# Altium schematic sheet SpeakEasy_Power_Connectors.SchDoc
size A
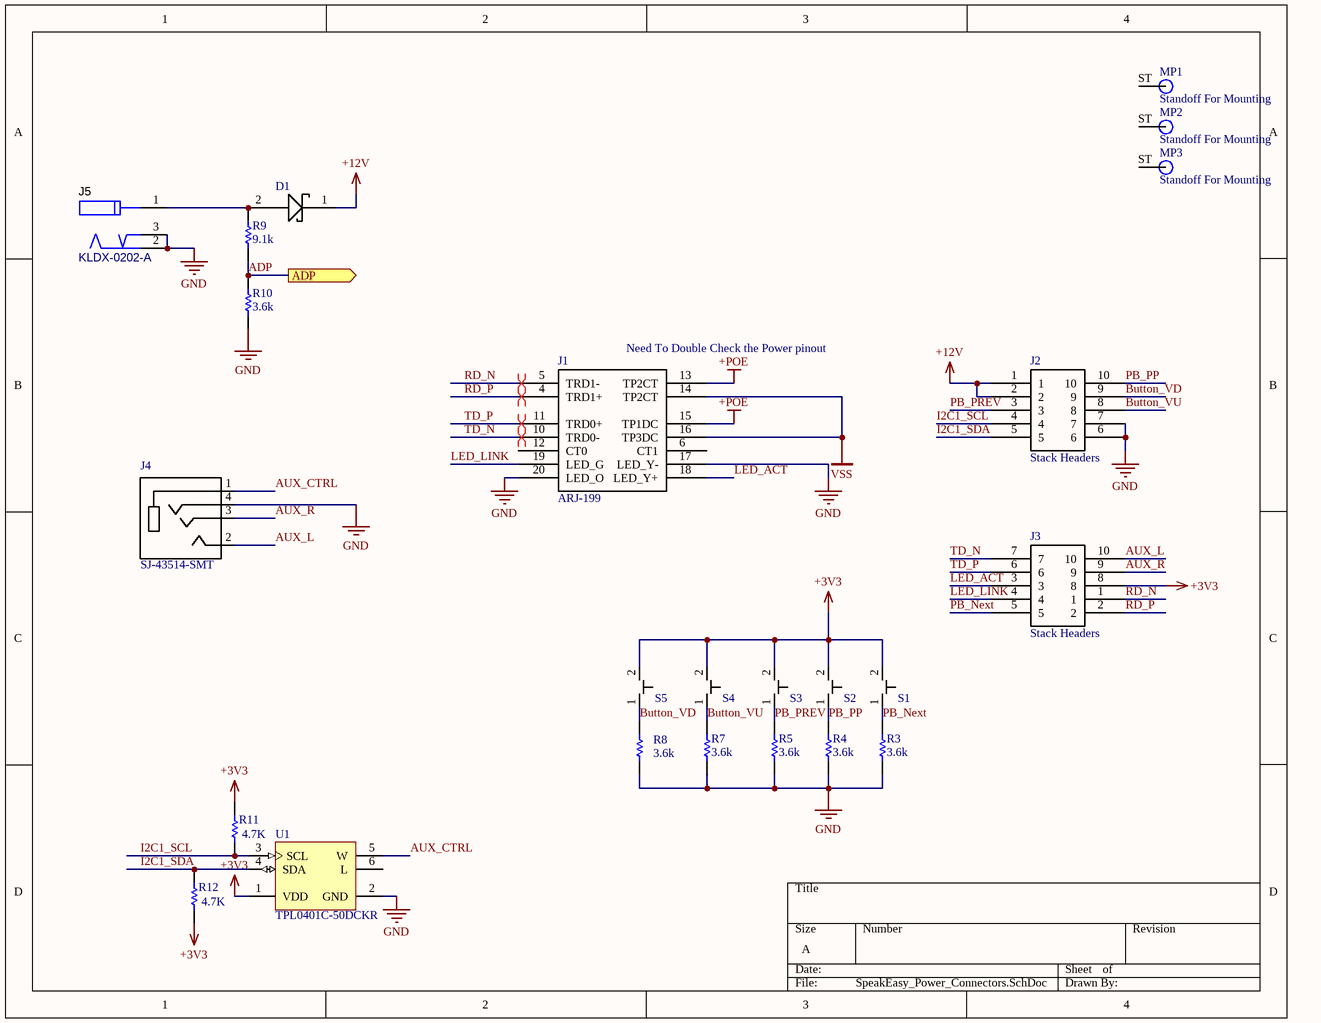
[diagram p0: SpeakEasy_Power_Connectors.SchDoc]

## Parts
D1  Shottkey Diode  [DO-220AA]  (value not drawn)
J1  ARJ-199  [ARJ-199]
J2  Stack Headers  [TSW-105]
J3  Stack Headers  [TSW-105]
J4  SJ-43514-SMT  [CUI_SJ-43514-SMT]
J5  KLDX-0202-A  [KYCN-KLDX-0202-A_V]
MP1  Standoff For Mounting  [STO]
MP2  Standoff For Mounting  [STO]
MP3  Standoff For Mounting  [STO]
R3  3.6k  [RESC0805(2012)_L]
R4  3.6k  [RESC0805(2012)_L]
R5  3.6k  [RESC0805(2012)_L]
R7  3.6k  [RESC0805(2012)_L]
R8  3.6k  [RESC0805(2012)_L]
R9  9.1k  [RESC0805(2012)_L]
R10  3.6k  [RESC0805(2012)_L]
R11  4.7k  [RESC0603(1608)_N]
R12  4.7K  [RESC0603(1608)_N]
S1  SPST Switch  [TL1105]  (value not drawn)
S2  SPST Switch  [TL1105]  (value not drawn)
S3  SPST Switch  [TL1105]  (value not drawn)
S4  SPST Switch  [TL1105]  (value not drawn)
S5  SPST Switch  [TL1105]  (value not drawn)
U1  TPL0401C-50DCKR  [TI-DCK6_V]

## Ports
ADP (out)

## Nets
+3V3: J3.8 R11.2 R12.1 S1.2 S2.2 S3.2 S4.2 S5.2 U1.1(VDD)
+12V: D1.1(-) J2.1 J2.2
+POE: J1.13(TP2CT) J1.15(TP1DC)
GND: J1.17(LED_Y-) J1.20(LED_O) J2.6 J2.7 J4.4(RING2) J5.2 J5.3 R3.2 R4.2 R5.2 R7.1 R8.1 R10.1 U1.2(GND)
VSS: J1.14(TP2CT) J1.16(TP3DC)
ADP: R9.1 R10.2 ; port ADP
AUX_CTRL: J4.1(SLEEVE) U1.5(W)
AUX_L: J3.10 J4.2(TIP)
AUX_R: J3.9 J4.3(RING1)
Button_VD: J2.9 R8.2 S5.1
Button_VU: J2.8 R7.2 S4.1
I2C1_SCL: J2.4 R11.1 U1.3(SCL)
I2C1_SDA: J2.5 R12.2 U1.4(SDA)
LED_ACT: J1.18(LED_Y+) J3.3
LED_LINK: J1.19(LED_G) J3.4
PB_Next: J3.5 R3.1 S1.1
PB_PP: J2.10 R4.1 S2.1
PB_PREV: J2.3 R5.1 S3.1
RD_N: J1.5(TRD1-) J3.1
RD_P: J1.4(TRD1+) J3.2
TD_N: J1.10(TRD0-) J3.7
TD_P: J1.11(TRD0+) J3.6
NetD1_2: D1.2(+) J5.1 R9.2

Not connected (* = marked no-connect by the designer): J1 6(CT1) 12(CT0); MP1 ST(1); MP2 ST(1); MP3 ST(1); U1 6(L)

## Layout directives
differential pair; differential pair class TX_DIFF; rule Matched Net Lengths [Tolerance = 20mil]: TD_N, TD_P
differential pair; differential pair class RX Diff; rule Matched Net Lengths [Tolerance = 20mil]: RD_N, RD_P

## Notes on the sheet
- (near J1) Need To Double Check the Power pinout

## Library data of the parts
D1 = V3P6: ComponentLink1Description: Datasheet; ComponentLink1URL: https://www.vishay.com/docs/89344/v3p6.pdf
J1 = ARJ-199: MagJack POE+ Jack
J2 J3 = Stack Headers: System: Connector
J5 = CMP-1673-00001-1: DC Power Connectors 2mm PCB JACK POWER JACK; ComponentLink1URL: http://www.mouser.com/ds/2/222/KLDX_0202_LT-334784.pdf; ComponentLink1Description: Datasheet; PackageReference: KLDX-0202-A; PartNumber: KLDX-0202-A
MP1-MP3 = Standoff
R3-R5 R7-R10 = CMP-1591-00002-1: 0805 (2012 Metric) Chip Resistor; Case-EIA: 0805; Case-Metric: 2012; PackageReference: RESC0805(2012)
R11 = CMP-1012-00122-1: 100K 0.1W 5% 0603 (1608 Metric)  SMD; Case-EIA: 0603; Case-Metric: 1608; Value: 4.7K; Tolerance: 5 %; Power: 0.1 W; Technology: SMT
R12 = CMP-1012-00122-1: Case-EIA: 0603; Tolerance: 5 %; Power: 0.1 W; Case-Metric: 1608; Value: 4.7K; Technology: SMT
U1 = CMP-0004-00347-1: 128 Tap Digital Potentiometer with I2C Interface, -40 to 125 degC, 6-pin SOT23 (DCK6); Manufacturer: Texas Instruments; INL(Max)(+/-LSB): 0.5; DNL(Max)(+/-LSB): 0.25; Settling Time(us): 0.152; Interface: I2C; PackageReference: DCK6; Code_JEDEC: MO-203; ComponentLink2Description: Datasheet; SubFamily: Digital Potentiometer; ComponentLink3URL: http://www.ti.com/litv/pdf/mpds114c; PackageDescription: 6-Pin Plastic Small Outline, Body 2 x 1.25 mm, Pitch 0.65 mm; ComponentLink3Description: Package Specification; Mounting Technology: Surface Mount; PackageVersion: 4093553-4/G, 01/2007; PartNumber: TPL0401C-50DCKR; ComponentLink2URL: http://www.ti.com/general/docs/lit/getliterature.tsp?genericPartNumber=TPL0401C-50&fileType=pdf; DatasheetVersion: SLIS144A; ComponentLink1URL: http://www.ti.com/; ComponentLink1Description: Manufacturer URL
J4 = SJ-43514-SMT: Value: *